# EAGLE design filament (EAGLE 9.6.2)
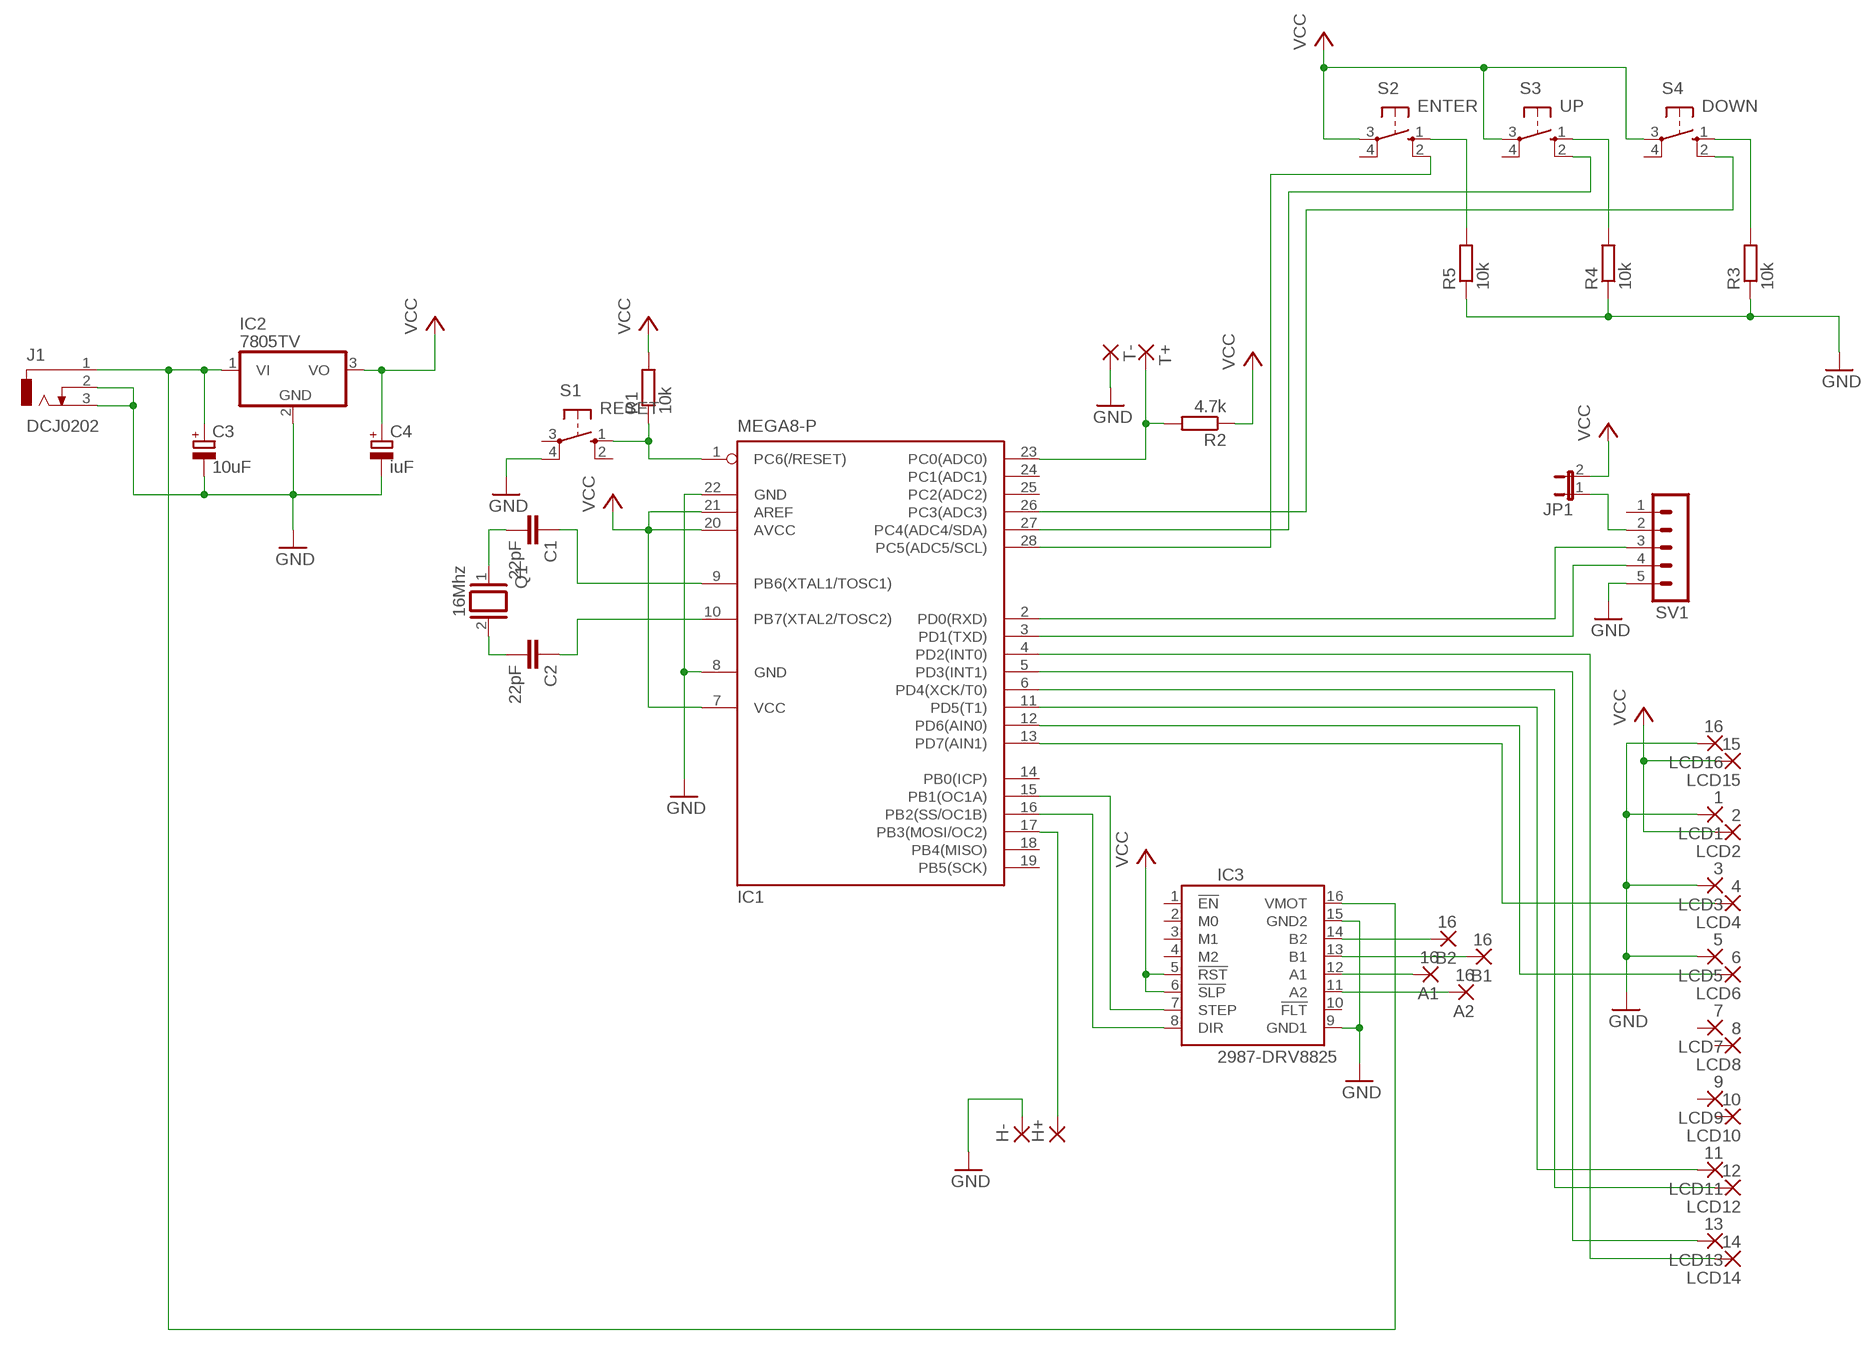
[diagram p0: schematic, sheet 1]

## Parts
A1  16  1,6/0,8  [1,6/0,8]
A2  16  1,6/0,8  [1,6/0,8]
B1  16  1,6/0,8  [1,6/0,8]
B2  16  1,6/0,8  [1,6/0,8]
C1  22pF  C-EU050-025X075  [C050-025X075]
C2  22pF  C-EU050-025X075  [C050-025X075]
C3  10uF  CPOL-EUE2-5  [E2-5]
C4  iuF  CPOL-EUE2-5  [E2-5]
H+  1,6/0,8  [1,6/0,8]
H-  1,6/0,8  [1,6/0,8]
IC1  MEGA8-P  [DIL28-3]
IC2  7805TV  [TO220V]
IC3  2987-DRV8825  [DRV8825]
J1  DCJ0202  [DCJ0202]
JP1  JP1E  [JP1]
LCD1  1  1,6/0,8  [1,6/0,8]
LCD2  2  1,6/0,8  [1,6/0,8]
LCD3  3  1,6/0,8  [1,6/0,8]
LCD4  4  1,6/0,8  [1,6/0,8]
LCD5  5  1,6/0,8  [1,6/0,8]
LCD6  6  1,6/0,8  [1,6/0,8]
LCD7  7  1,6/0,8  [1,6/0,8]
LCD8  8  1,6/0,8  [1,6/0,8]
LCD9  9  1,6/0,8  [1,6/0,8]
LCD10  10  1,6/0,8  [1,6/0,8]
LCD11  11  1,6/0,8  [1,6/0,8]
LCD12  12  1,6/0,8  [1,6/0,8]
LCD13  13  1,6/0,8  [1,6/0,8]
LCD14  14  1,6/0,8  [1,6/0,8]
LCD15  15  1,6/0,8  [1,6/0,8]
LCD16  16  1,6/0,8  [1,6/0,8]
Q1  16Mhz  XTAL/S  [QS]
R1  10k  R-EU_0207/10  [0207/10]
R2  4.7k  R-EU_0207/10  [0207/10]
R3  10k  R-EU_0207/10  [0207/10]
R4  10k  R-EU_0207/10  [0207/10]
R5  10k  R-EU_0207/10  [0207/10]
S1  RESET  10-XX  [B3F-10XX]
S2  ENTER  10-XX  [B3F-10XX]
S3  UP  10-XX  [B3F-10XX]
S4  DOWN  10-XX  [B3F-10XX]
SV1  MA05-1  [MA05-1]
T+  1,6/0,8  [1,6/0,8]
T-  1,6/0,8  [1,6/0,8]

## Nets
GND: C3.- C4.- H-.1(P) IC1.8(GND) IC1.22(GND) IC2.2(GND) IC3.9(GND1) IC3.15(GND2) J1.2 J1.3 LCD1.1(P) LCD3.1(P) LCD5.1(P) LCD16.1(P) R3.1 R4.1 R5.1 S1.4(P1) SV1.5 T-.1(P)
N$1: C1.2 Q1.1
N$2: C2.2 Q1.2
N$3: C2.1 IC1.10(PB7(XTAL2/TOSC2))
N$4: C1.1 IC1.9(PB6(XTAL1/TOSC1))
N$5: IC1.1(PC6(/RESET)) R1.1 S1.1(S)
N$6: B2.1(P) IC3.14(B2)
N$7: IC1.3(PD1(TXD)) SV1.4
N$8: IC1.2(PD0(RXD)) SV1.3
N$9: JP1.1 SV1.2
N$10: IC1.4(PD2(INT0)) LCD14.1(P)
N$11: IC1.5(PD3(INT1)) LCD13.1(P)
N$12: IC1.6(PD4(XCK/T0)) LCD12.1(P)
N$13: IC1.11(PD5(T1)) LCD11.1(P)
N$14: IC1.23(PC0(ADC0)) R2.2 T+.1(P)
N$15: IC1.13(PD7(AIN1)) LCD4.1(P)
N$16: H+.1(P) IC1.17(PB3(MOSI/OC2))
N$17: IC1.12(PD6(AIN0)) LCD6.1(P)
N$18: R5.2 S2.1(S)
N$19: R4.2 S3.1(S)
N$20: R3.2 S4.1(S)
N$21: IC1.28(PC5(ADC5/SCL)) S2.2(S1)
N$22: IC1.27(PC4(ADC4/SDA)) S3.2(S1)
N$23: IC1.26(PC3(ADC3)) S4.2(S1)
N$24: IC1.15(PB1(OC1A)) IC3.7(STEP)
N$25: IC1.16(PB2(SS/OC1B)) IC3.8(DIR)
N$26: B1.1(P) IC3.13(B1)
N$27: C3.+ IC2.1(VI) IC3.16(VMOT) J1.1
N$28: A1.1(P) IC3.12(A1)
N$29: A2.1(P) IC3.11(A2)
VCC: C4.+ IC1.7(VCC) IC1.20(AVCC) IC1.21(AREF) IC2.3(VO) IC3.5(!RST) IC3.6(!SLP) JP1.2 LCD2.1(P) LCD15.1(P) R1.2 R2.1 S2.3(P) S3.3(P) S4.3(P)
Unconnected: IC1.14(PB0(ICP)) IC1.18(PB4(MISO)) IC1.19(PB5(SCK)) IC1.24(PC1(ADC1)) IC1.25(PC2(ADC2)) IC3.1(!EN) IC3.2(M0) IC3.3(M1) IC3.4(M2) IC3.10(!FLT) LCD7.1(P) LCD8.1(P) LCD9.1(P) LCD10.1(P) S1.2(S1) S1.3(P) S2.4(P1) S3.4(P1) S4.4(P1) SV1.1

## Library data of the parts
A1 A2 B1 B2 H+ H- LCD1-LCD16 T+ T- = wirepad:1,6/0,8: THROUGH-HOLE PAD
C1 C2 = rcl:C-EU: CAPACITOR, European symbol; SPICEPREFIX: C
C3 C4 = rcl:CPOL-EU: POLARIZED CAPACITOR, European symbol; SPICEPREFIX: C
IC1 = atmel:MEGA8-P: MICROCONTROLLER 8 Kbytes FLASH, 1 kbytes SRAM, 512 bytes EEPROM, USART, 4-channel 10 bit ADC, 2-channel 8 bit ADC Pin compatible with Atmega48, ATMega88, ATMega168 Source: avr.lbr; OC_FARNELL: unknown; OC_NEWARK: unknown
IC2 = linear:78*: Positive VOLTAGE REGULATOR Source: http://cache.national.com/ds/LM/LM78L05.pdf http://www.fairchildsemi.com/ds/LM/LM7805.pdf
IC3 = pololu-stepper-driver:2987-DRV8825: DRV8825 Stepper Motor Driver Carrier; High Current (Bulk; Header Pins Soldered) #2987 DRV8825 Stepper Motor Driver Carrier; High Current (Bulk; Header Pins Soldered) <https://www.pololu.com/product/2987> in Japan, Suzaku Lab. Ltd. <https://suzakugiken.jp/> #2987 DRV8825 大電流ステッピングモータドライバボード (バルク品 ピンヘッダ実装済み) <https://szc.jp/po2987>
J1 = con-jack:DCJ0202: DC POWER JACK Source: DCJ0202.pdf; OC_FARNELL: unknown; OC_NEWARK: unknown
JP1 = jumper:JP1E: JUMPER
Q1 = special:XTAL/S: CRYSTAL
R1-R5 = rcl:R-EU_: RESISTOR, European symbol; SPICEPREFIX: R
S1-S4 = switch-omron:10-XX: OMRON SWITCH
SV1 = con-lstb:MA05-1: PIN HEADER; OC_FARNELL: unknown; OC_NEWARK: unknown

## Board
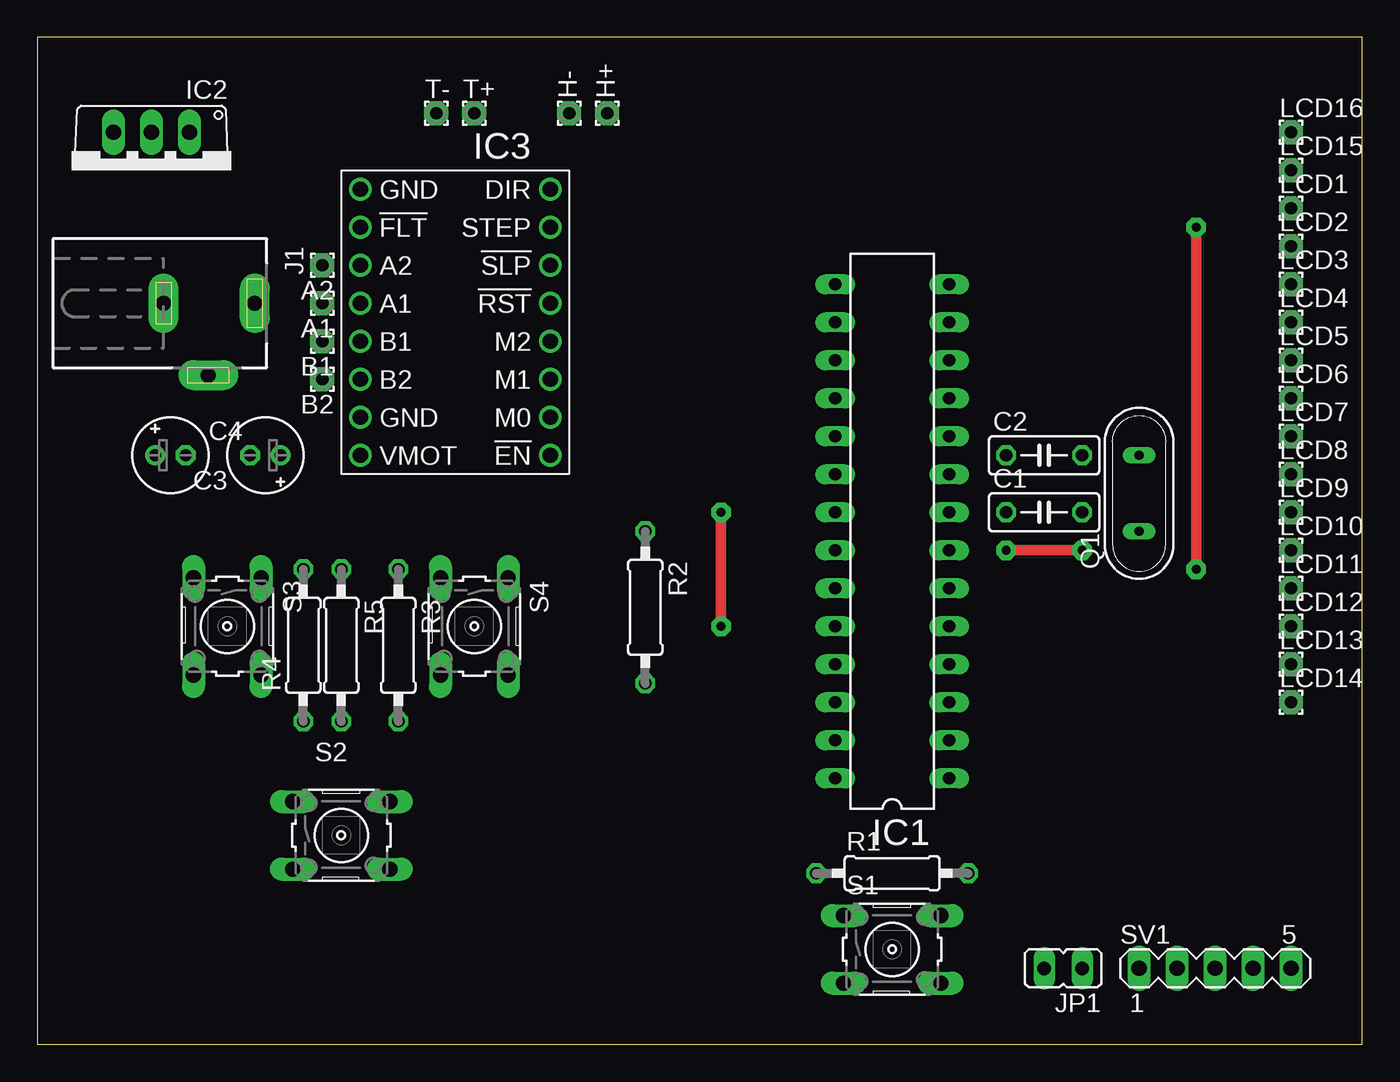
[diagram p1: board, top side]
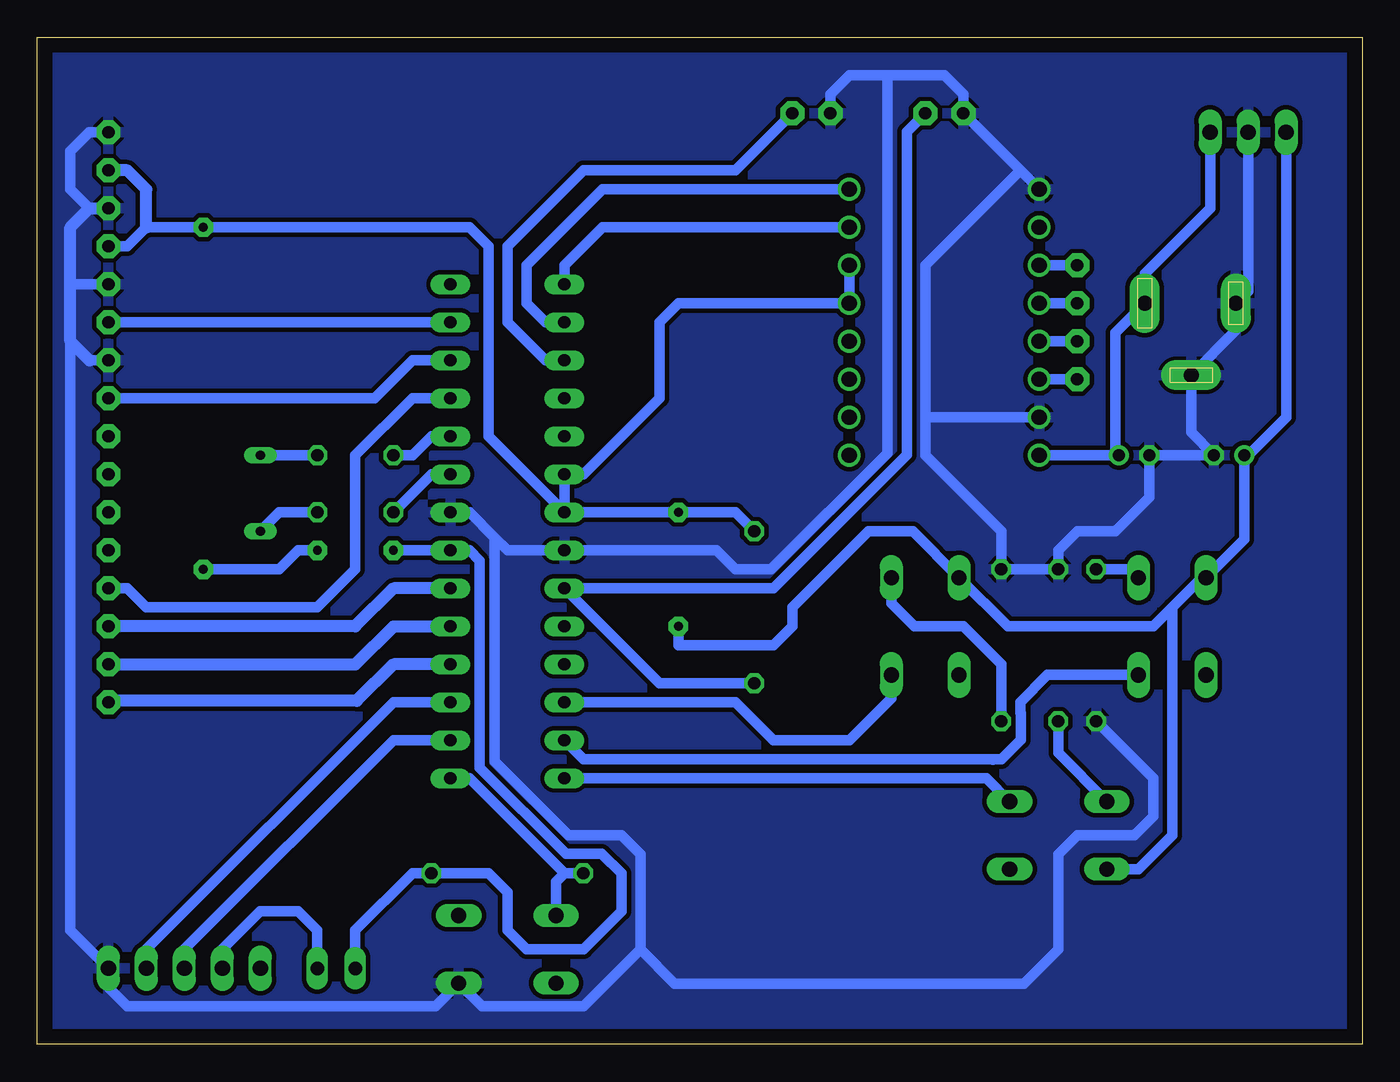
[diagram p2: board, bottom side, seen from below]

Size 88.57 x 67.3 mm. Coordinates in mm from the lower left corner, seen from the top.
Outline: 0,0 88.57,0 88.57,67.3 0,67.3 0,0
Copper layers (1*16): Top 0.035mm / dielectric 1.5mm / Bottom 0.035mm
Design rules "default *": minimum track width 0.7mm, minimum drill 0.35mm, track to track 0.3mm, track to pad 0.3mm, pad to pad 0.3mm, via to via 0.3mm, smd to smd 6mil, copper to edge 40mil, drill to drill 7mil, minimum pad ring 10mil, minimum via ring 8mil, stop-mask expansion 4mil, vias tented up to drill 0mil, thermal gap 10mil

### Footprints (pad centres in the part's own frame; a part is rotated, then mirrored left to right if it is on the bottom)
1,6/0,8 = drill 0.813 pad 1.6 octagon: 1 0,0
C050-025X075 = drill 0.813 octagon: 1 -2.54,0; 2 2.54,0
E2-5 = drill 0.813 pad 1.27: + -1.016,0 | drill 0.813 pad 1.27 octagon: - 1.016,0
DIL28-3 = drill 0.813 long: 1 -16.51,-3.81; 2 -13.97,-3.81; 3 -11.43,-3.81; 4 -8.89,-3.81; 5 -6.35,-3.81; 6 -3.81,-3.81; 7 -1.27,-3.81; 8 1.27,-3.81; 9 3.81,-3.81; 10 6.35,-3.81; 11 8.89,-3.81; 12 11.43,-3.81; 13 13.97,-3.81; 14 16.51,-3.81; 15 16.51,3.81; 16 13.97,3.81; 17 11.43,3.81; 18 8.89,3.81; 19 6.35,3.81; 20 3.81,3.81; 21 1.27,3.81; 22 -1.27,3.81; 23 -3.81,3.81; 24 -6.35,3.81; 25 -8.89,3.81; 26 -11.43,3.81; 27 -13.97,3.81; 28 -16.51,3.81
TO220V = drill 1.016 long: 1 -2.54,-2.54; 2 0,-2.54; 3 2.54,-2.54
DRV8825 = drill 1.016: 1 -6.35,8.89; 2 -6.35,6.35; 3 -6.35,3.81; 4 -6.35,1.27; 5 -6.35,-1.27; 6 -6.35,-3.81; 7 -6.35,-6.35; 8 -6.35,-8.89; 9 6.35,-8.89; 10 6.35,-6.35; 11 6.35,-3.81; 12 6.35,-1.27; 13 6.35,1.27; 14 6.35,3.81; 15 6.35,6.35; 16 6.35,8.89
DCJ0202 = drill 1 pad 2 long: 1 0,3.1; 2 4.8,0; 3 0,-3
JP1 = drill 0.914 long: 1 0,-1.27; 2 0,1.27
QS = drill 0.61 long: 1 -2.54,0; 2 2.54,0
0207/10 = drill 0.813 octagon: 1 -5.08,0; 2 5.08,0
B3F-10XX = drill 1.016 long: 1 -3.251,2.261; 2 3.251,2.261; 3 -3.251,-2.261; 4 3.251,-2.261
MA05-1 = drill 1.016 long: 1 -5.08,0; 2 -2.54,0; 3 0,0; 4 2.54,0; 5 5.08,0

### Placement (x,y rotation side)
A1  19.05,49.53 180 top
A2  19.05,52.07 180 top
B1  19.05,46.99 180 top
B2  19.05,44.45 180 top
C1  67.31,35.56 0 top
C2  67.31,39.37 0 top
C3  15.24,39.37 180 top
C4  8.89,39.37 0 top
H+  38.1,62.23 0 top
H-  35.56,62.23 0 top
IC1  57.15,34.29 90 top
IC2  7.62,58.42 180 top
IC3  27.94,48.26 180 top
J1  11.43,49.53 270 top
JP1  68.58,5.08 90 top
LCD1  83.82,55.88 0 top
LCD2  83.82,53.34 0 top
LCD3  83.82,50.8 0 top
LCD4  83.82,48.26 0 top
LCD5  83.82,45.72 0 top
LCD6  83.82,43.18 0 top
LCD7  83.82,40.64 0 top
LCD8  83.82,38.1 0 top
LCD9  83.82,35.56 0 top
LCD10  83.82,33.02 0 top
LCD11  83.82,30.48 0 top
LCD12  83.82,27.94 0 top
LCD13  83.82,25.4 0 top
LCD14  83.82,22.86 0 top
LCD15  83.82,58.42 0 top
LCD16  83.82,60.96 0 top
Q1  73.66,36.83 90 top
R1  57.15,11.43 0 top
R2  40.64,29.21 270 top
R3  24.13,26.67 270 top
R4  17.78,26.67 90 top
R5  20.32,26.67 270 top
S1  57.15,6.35 0 top
S2  20.32,13.97 0 top
S3  12.7,27.94 270 top
S4  29.21,27.94 270 top
SV1  78.74,5.08 0 top
T+  29.21,62.23 0 top
T-  26.67,62.23 0 top

### Tracks (layer width: path | path; a pad name or v marks a point on that pad's centre or on a via)
GND
  Bottom 0.7: LCD16.1 85.09,60.96 86.36,59.69 86.36,57.15 85.09,55.88 | 48.26,6.35 52.07,2.54 58.85,2.54 S1.4 61.95,2.54 82.55,2.54 83.82,3.81 SV1.5 86.36,7.62 86.36,46.99 | 48.26,6.35 48.26,12.7 49.53,13.97 53.05,13.97 57.99,18.91 57.99,33.86 | IC1.8 59.69,35.56 57.99,33.86 | 29.21,41.91 IC3.15 | 57.99,33.86 57.15,33.02 IC1.22 43.18,33.02 41.91,31.75 39.51,31.75 31.75,39.51 31.75,64.77 | 48.26,6.35 45.97,4.06 22.61,4.06 20.32,6.35 20.32,12.7 19.05,13.97 15.24,13.97 13.97,15.24 13.97,17.78 R4.1 | IC3.9 22.86,58.42 | 22.86,58.42 T-.1 26.67,63.5 27.94,64.77 31.75,64.77 | LCD5.1 85.09,45.72 | IC2.2 7.62,50.34 J1.3 8.43,47.73 J1.2 11.43,40.89 C4.- C3.- 14.22,36.58 16.51,34.29 19.05,34.29 20.32,33.02 R5.1 R3.1 24.13,34.29 29.21,39.37 29.21,41.91 | 22.86,58.42 29.21,52.07 29.21,41.91 | LCD3.1 86.36,50.8 | H-.1 35.56,63.5 34.29,64.77 31.75,64.77
  Bottom 0.8: 85.09,45.72 86.36,46.99 86.36,50.8 86.36,54.61 85.09,55.88 LCD1.1
  pour Bottom: 0,67.31 88.9,67.31 88.9,0 0,0
N$1
  Bottom 0.7: C1.2 72.39,35.56 Q1.1
N$2
  Bottom 0.7: Q1.2 C2.2
N$3
  Bottom 0.7: IC1.10 62.23,40.64 63.5,39.37 C2.1
N$4
  Bottom 0.7: IC1.9 62.23,38.1 C1.1
N$5
  Bottom 0.7: S1.1 53.9,10.87 53.34,11.43 | 53.34,11.43 R1.1 | IC1.1 59.69,17.78 53.34,11.43
N$6
  Bottom 0.7: IC3.14 B2.1
N$7
  Bottom 0.7: IC1.3 64.77,22.86 81.28,6.35 SV1.4
N$8
  Bottom 0.7: IC1.2 64.77,20.32 78.74,6.35 SV1.3
N$9
  Bottom 0.7: JP1.1 69.85,7.62 71.12,8.89 73.66,8.89 76.2,6.35 SV1.2
N$10
  Bottom 0.8: LCD14.1 83.73,22.95 67.22,22.95 64.77,25.4 IC1.4
N$11
  Bottom 0.8: LCD13.1 67.31,25.4 64.77,27.94 IC1.5
N$12
  Bottom 0.8: IC1.6 64.77,30.48 67.31,27.94 LCD12.1
N$13
  Bottom 0.7: IC1.11 63.5,43.18 67.31,39.37 67.31,31.75 69.85,29.21 81.28,29.21 82.55,30.48 LCD11.1
N$14
  Bottom 0.7: R2.2 46.99,24.13 IC1.23 39.37,30.48 30.44,39.41 30.44,61 T+.1
N$15
  Bottom 0.7: LCD4.1 IC1.13
N$16
  Bottom 0.7: IC1.17 54.61,45.72 57.15,48.26 57.15,53.34 52.07,58.42 41.91,58.42 H+.1
N$17
  Bottom 0.7: 62.23,45.72 IC1.12 63.5,45.72 66.04,43.18 LCD6.1
N$18
  Bottom 0.7: R5.2 20.32,19.48 S2.1
N$19
  Bottom 0.7: R4.2 15.24,31.75 14.96,31.47 S3.1
N$20
  Bottom 0.7: S4.1 31.47,29.49 29.92,27.94 26.67,27.94 24.13,25.4 R3.2
N$21
  Bottom 0.7: S2.2 25.12,17.78 IC1.28
N$22
  Bottom 0.7: IC1.27 52.07,19.05 24.71,19.05 | 24.71,19.05 24.67,19.01 | 24.71,19.05 24.13,19.05 22.82,20.36 22.82,22.13 22.86,22.17 22.86,22.86 21.03,24.69 S3.2
N$23
  Bottom 0.7: S4.2 31.47,23.14 34.29,20.32 39.37,20.32 41.91,22.86 IC1.26
N$24
  Bottom 0.7: IC1.15 53.34,52.07 50.8,54.61 IC3.7
N$25
  Bottom 0.7: IC3.8 50.8,57.15 55.88,52.07 55.88,49.53 54.61,48.26 IC1.16
N$26
  Bottom 0.7: IC3.13 B1.1
N$27
  Bottom 0.7: C3.+ 16.51,39.37 | 16.51,39.37 IC3.16 | IC2.1 10.16,55.88 14.53,51.51 J1.1 16.51,47.55 16.51,39.37
N$28
  Bottom 0.7: A1.1 IC3.12
N$29
  Bottom 0.7: IC3.11 A2.1
VCC  (via drill 0.6 pad 1.3)
  Top 0.7: v64.77,33.02 v69.85,33.02 | v77.47,31.75 v77.47,54.61 | v45.72,35.56 v45.72,27.94
  Bottom 0.7: JP1.2 67.31,7.62 63.5,11.43 R1.2 58.42,11.43 57.15,10.16 57.15,7.62 55.88,6.35 52.07,6.35 49.53,8.89 49.53,11.43 50.84,12.74 53.24,12.74 58.99,18.49 58.99,32.32 59.69,33.02 IC1.7 v64.77,33.02 | IC3.6 IC3.5 45.72,49.53 46.99,48.26 46.99,43.18 52.07,38.1 IC1.20 IC1.21 | IC1.21 v45.72,35.56 41.91,35.56 R2.1 | 12.7,29.21 10.72,31.19 S3.3 7.87,33.76 C4.+ 7.62,39.37 5.08,41.91 IC2.3 | 12.7,29.21 13.97,27.94 23.7,27.94 S4.3 30.05,34.29 33.02,34.29 38.1,29.21 38.1,27.94 39.37,26.67 45.72,26.67 v45.72,27.94 | 15.77,11.71 S2.3 14.96,11.71 12.7,13.97 12.7,29.21 | v69.85,33.02 71.12,33.02 72.39,31.75 v77.47,31.75 | IC1.21 58.42,40.64 58.42,53.34 59.69,54.61 v77.47,54.61 81.28,54.61 82.55,53.34 LCD2.1
  Bottom 0.8: LCD15.1 82.55,58.42 81.28,57.15 81.28,54.61